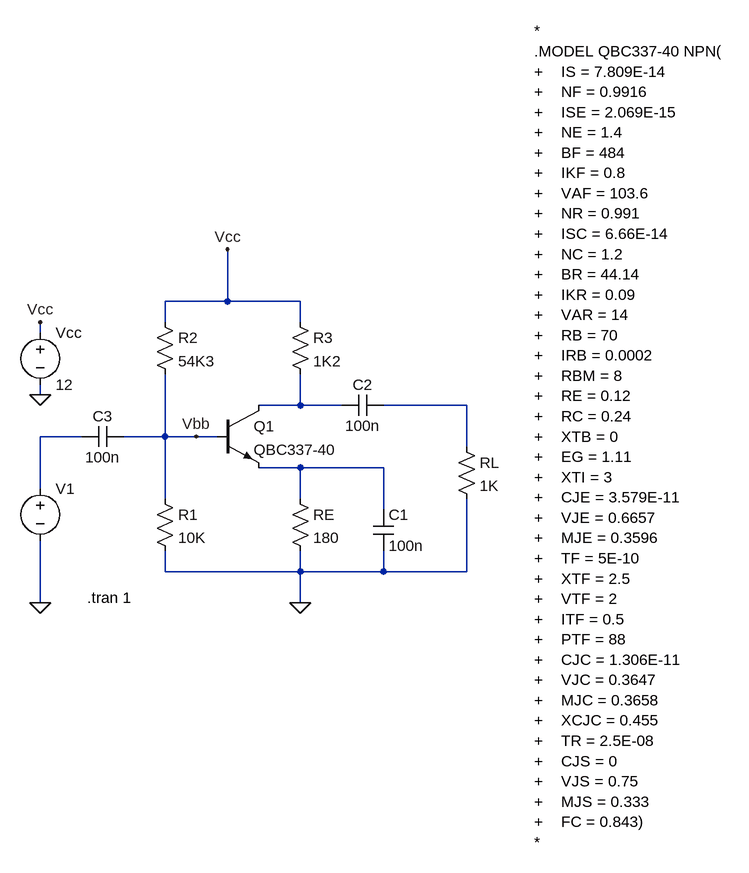
[diagram p0: schematic bjt-real.asc]
bjt-real.asc, the LTspice schematic file:
Version 4.1
SHEET 1 988 680
WIRE 208 -80 208 -160
WIRE 208 -80 112 -80
WIRE 320 -80 208 -80
WIRE 112 -48 112 -80
WIRE 320 -48 320 -80
WIRE -80 -32 -80 -48
WIRE -80 64 -80 48
WIRE 320 80 320 32
WIRE 320 80 256 80
WIRE 384 80 320 80
WIRE 576 80 448 80
WIRE -16 128 -80 128
WIRE 112 128 112 32
WIRE 112 128 48 128
WIRE 160 128 112 128
WIRE 192 128 160 128
WIRE 576 144 576 80
WIRE 320 176 256 176
WIRE 448 176 320 176
WIRE -80 208 -80 128
WIRE 112 224 112 128
WIRE 320 224 320 176
WIRE 448 240 448 176
WIRE 112 336 112 304
WIRE 320 336 320 304
WIRE 320 336 112 336
WIRE 448 336 448 304
WIRE 448 336 320 336
WIRE 576 336 576 224
WIRE 576 336 448 336
WIRE -80 384 -80 288
WIRE 320 384 320 336
FLAG 320 384 0
FLAG 208 -160 Vcc
FLAG -80 384 0
FLAG -80 64 0
FLAG -80 -48 Vcc
FLAG 160 128 Vbb
SYMBOL npn 192 80 R0
SYMATTR InstName Q1
SYMATTR Value QBC337-40
SYMBOL res 96 208 R0
SYMATTR InstName R1
SYMATTR Value 10K
SYMBOL res 96 -64 R0
SYMATTR InstName R2
SYMATTR Value 54K3
SYMBOL res 304 -64 R0
SYMATTR InstName R3
SYMATTR Value 1K2
SYMBOL res 304 208 R0
SYMATTR InstName RE
SYMATTR Value 180
SYMBOL cap 432 240 R0
SYMATTR InstName C1
SYMATTR Value 100n
SYMBOL cap 448 64 R90
WINDOW 0 0 32 VBottom 2
WINDOW 3 32 32 VTop 2
SYMATTR InstName C2
SYMATTR Value 100n
SYMBOL res 560 128 R0
SYMATTR InstName RL
SYMATTR Value 1K
SYMBOL voltage -80 192 R0
WINDOW 123 0 0 Left 0
WINDOW 39 0 0 Left 0
SYMATTR InstName V1
SYMATTR Value ""
SYMBOL voltage -80 -48 R0
WINDOW 123 0 0 Left 0
WINDOW 39 0 0 Left 0
SYMATTR InstName Vcc
SYMATTR Value 12
SYMBOL cap 48 112 R90
WINDOW 0 0 32 VBottom 2
WINDOW 3 32 32 VTop 2
SYMATTR InstName C3
SYMATTR Value 100n
TEXT -8 376 Left 2 !.tran 1
TEXT 680 -496 Left 2 !*\n.MODEL QBC337-40 NPN( \n+    IS = 7.809E-14 \n+    NF = 0.9916 \n+    ISE = 2.069E-15 \n+    NE = 1.4 \n+    BF = 484\n+    IKF = 0.8 \n+    VAF = 103.6 \n+    NR = 0.991 \n+    ISC = 6.66E-14 \n+    NC = 1.2 \n+    BR = 44.14 \n+    IKR = 0.09 \n+    VAR = 14 \n+    RB = 70 \n+    IRB = 0.0002 \n+    RBM = 8 \n+    RE = 0.12 \n+    RC = 0.24 \n+    XTB = 0 \n+    EG = 1.11 \n+    XTI = 3 \n+    CJE = 3.579E-11 \n+    VJE = 0.6657 \n+    MJE = 0.3596 \n+    TF = 5E-10 \n+    XTF = 2.5 \n+    VTF = 2 \n+    ITF = 0.5 \n+    PTF = 88 \n+    CJC = 1.306E-11 \n+    VJC = 0.3647 \n+    MJC = 0.3658 \n+    XCJC = 0.455 \n+    TR = 2.5E-08 \n+    CJS = 0 \n+    VJS = 0.75 \n+    MJS = 0.333 \n+    FC = 0.843) \n*

The netlist it stands for:
* bjt-real.asc
Q1 N001 Vbb N004 0 QBC337-40
R1 Vbb 0 10K
R2 Vcc Vbb 54K3
R3 Vcc N001 1K2
RE N004 0 180
C1 N004 0 100n
C2 N002 N001 100n
RL N002 0 1K
V1 N003 0
Vcc Vcc 0 12
C3 Vbb N003 100n
.model NPN NPN
.model PNP PNP
.lib standard.bjt
.tran 1
*
.MODEL QBC337-40 NPN(
+    IS = 7.809E-14
+    NF = 0.9916
+    ISE = 2.069E-15
+    NE = 1.4
+    BF = 484
+    IKF = 0.8
+    VAF = 103.6
+    NR = 0.991
+    ISC = 6.66E-14
+    NC = 1.2
+    BR = 44.14
+    IKR = 0.09
+    VAR = 14
+    RB = 70
+    IRB = 0.0002
+    RBM = 8
+    RE = 0.12
+    RC = 0.24
+    XTB = 0
+    EG = 1.11
+    XTI = 3
+    CJE = 3.579E-11
+    VJE = 0.6657
+    MJE = 0.3596
+    TF = 5E-10
+    XTF = 2.5
+    VTF = 2
+    ITF = 0.5
+    PTF = 88
+    CJC = 1.306E-11
+    VJC = 0.3647
+    MJC = 0.3658
+    XCJC = 0.455
+    TR = 2.5E-08
+    CJS = 0
+    VJS = 0.75
+    MJS = 0.333
+    FC = 0.843)
*
.backanno
.end